# EAGLE design Arducard (EAGLE 6.5.0)
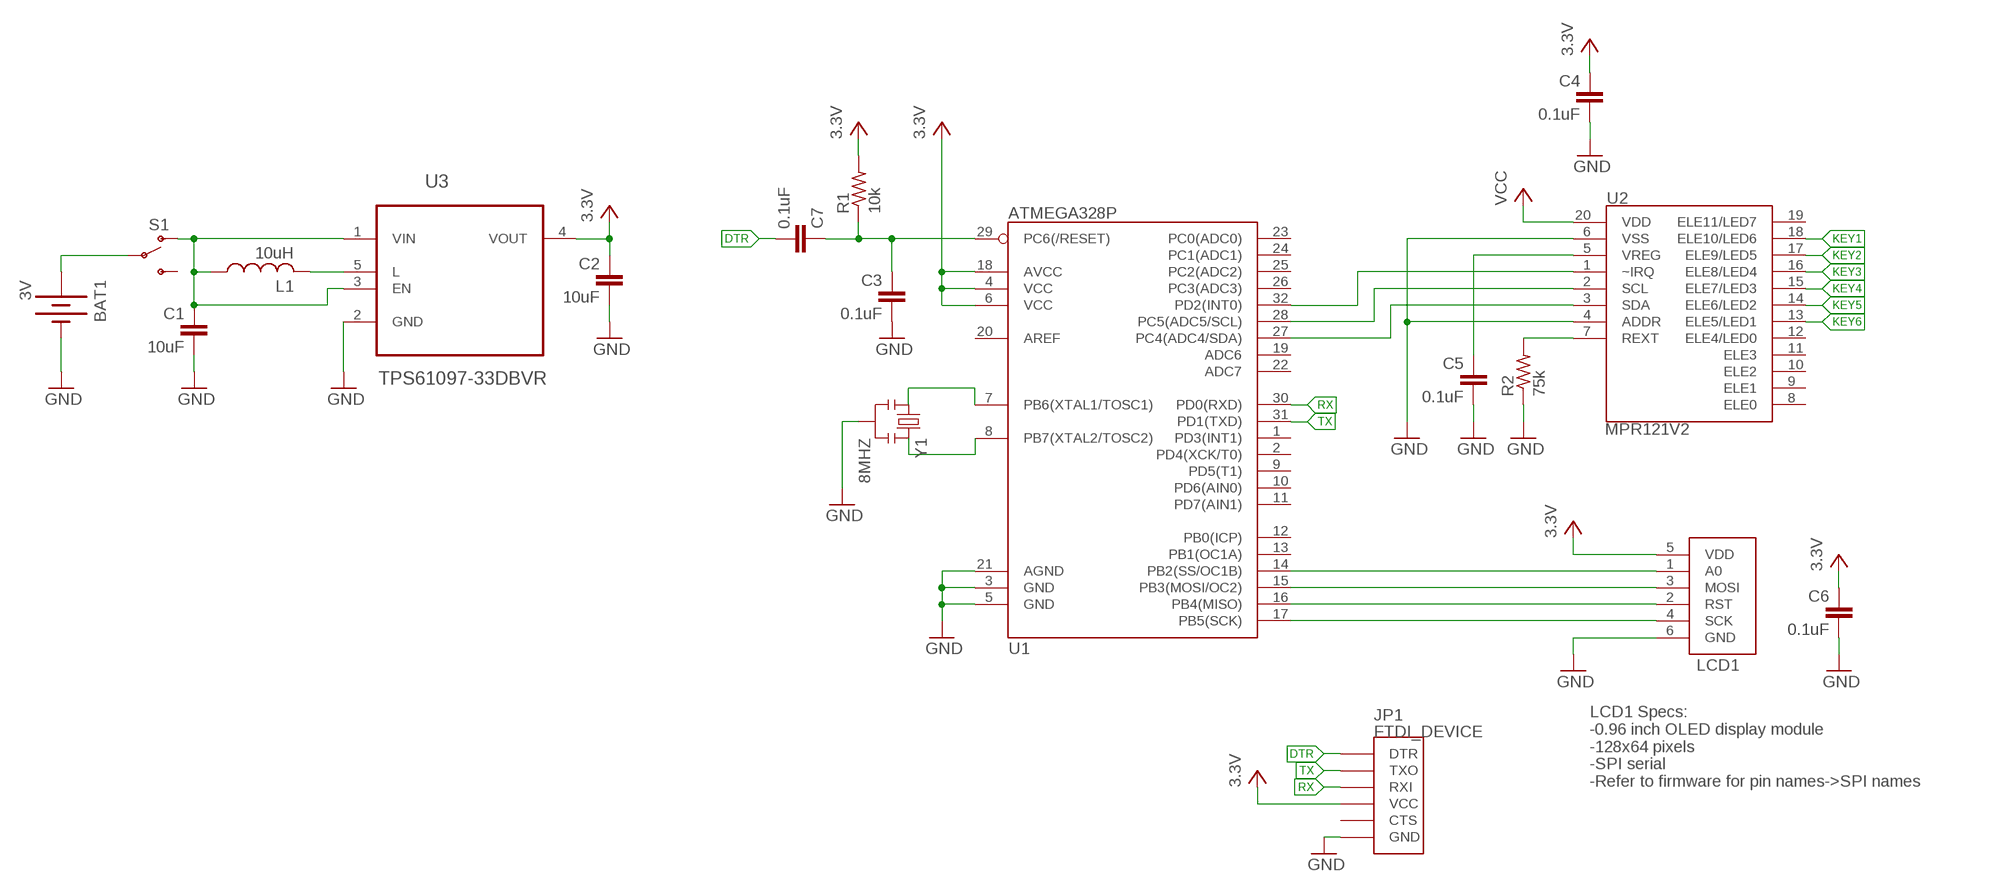
[diagram p0: schematic, sheet 1]

## Parts
BAT1  3V  BATTERY20MM_4LEGS  [BATTCON_20MM_4LEGS]
C1  10uF  C-EUC0603K  [C0603K]
C2  10uF  C-EUC0603K  [C0603K]
C3  0.1uF  C-EUC0603K  [C0603K]
C4  0.1uF  C-EUC0603K  [C0603K]
C5  0.1uF  C-EUC0603K  [C0603K]
C6  0.1uF  C-EUC0603K  [C0603K]
C7  0.1uF  C-EUC0603K  [C0603K]
JP1  FTDI_DEVICE  [FTDI_DEVICE_SIDE]
L1  10uH  L-USL2012C  [L2012C]
LCD1  LCD  [LCD]
R1  10k  R-US_R0603  [R0603]
R2  75k  R-US_R0603  [R0603]
S1  SWITCH-SPDTSMD2  [SWITCH-SPDT-SMD]
U1  ATMEGA328P  ATMEGA328_SMT  [TQFP32-08]
U2  MPR121V2  [QFN-20-0.4MM-V2]
U3  TPS61097-33DBVR  [SOT95P280X145-5N]
Y1  8MHZ  RESONATOR16MHZ  [RESONATOR-SMD]

## Nets
DTR: C7.2 JP1.P$1(DTR)
GND: BAT1.2(-) C1.2 C2.2 C3.2 C4.2 C5.2 C6.2 JP1.P$6(GND) LCD1.6(GND) R2.1 U1.3(GND) U1.5(GND) U1.21(AGND) U2.4(ADDR) U2.6(VSS) U3.2(GND) Y1.2
KEY1: U2.18(ELE10/LED6)
KEY2: U2.17(ELE9/LED5)
KEY3: U2.16(ELE8/LED4)
KEY4: U2.15(ELE7/LED3)
KEY5: U2.14(ELE6/LED2)
KEY6: U2.13(ELE5/LED1)
N$1: LCD1.4(SCK) U1.17(PB5(SCK))
N$2: LCD1.2(RST) U1.16(PB4(MISO))
N$3: LCD1.3(MOSI) U1.15(PB3(MOSI/OC2))
N$4: LCD1.1(A0) U1.14(PB2(SS/OC1B))
N$5: R2.2 U2.7(REXT)
N$6: C5.1 U2.5(VREG)
N$7: U1.32(PD2(INT0)) U2.1(~IRQ)
N$8: U1.28(PC5(ADC5/SCL)) U2.2(SCL)
N$9: U1.27(PC4(ADC4/SDA)) U2.3(SDA)
N$10: U1.7(PB6(XTAL1/TOSC1)) Y1.1
N$11: U1.8(PB7(XTAL2/TOSC2)) Y1.3
N$12: C3.1 C7.1 R1.1 U1.29(PC6(/RESET))
N$15: L1.2 U3.5(L)
N$16: C1.1 L1.1 S1.1(O) U3.1(VIN) U3.3(EN)
N$17: BAT1.P$2(+) S1.2(P)
RX: JP1.P$3(RXI) U1.30(PD0(RXD))
TX: JP1.P$2(TXO) U1.31(PD1(TXD))
VCC: C2.1 C4.1 C6.1 JP1.P$4(VCC) LCD1.5(VDD) R1.2 U1.4(VCC) U1.6(VCC) U1.18(AVCC) U2.20(VDD) U3.4(VOUT) ; supply symbol labelled 3.3V
Unconnected: JP1.P$5(CTS) S1.3(S) U1.1(PD3(INT1)) U1.2(PD4(XCK/T0)) U1.9(PD5(T1)) U1.10(PD6(AIN0)) U1.11(PD7(AIN1)) U1.12(PB0(ICP)) U1.13(PB1(OC1A)) U1.19(ADC6) U1.20(AREF) U1.22(ADC7) U1.23(PC0(ADC0)) U1.24(PC1(ADC1)) U1.25(PC2(ADC2)) U1.26(PC3(ADC3)) U2.8(ELE0) U2.9(ELE1) U2.10(ELE2) U2.11(ELE3) U2.12(ELE4/LED0) U2.19(ELE11/LED7)

## Notes on the sheet
- LCD1 Specs:
  -0.96 inch OLED display module
  -128x64 pixels
  -SPI serial
  -Refer to firmware for pin names->SPI names

## Library data of the parts
BAT1 = SparkFun-Electromechanical:BATTERY: Battery Holders Various common sizes : AA, AAA, 20mm coin cell and 12mm coin cell. 20MM_4LEGS, BATT-10373; OC_NEWARK: unknown; PROD_ID: BATT-10373; VALUE: 20mm coincell
C1-C7 = resistor:C-EU: CAPACITOR, European symbol; OC_NEWARK: unknown
JP1 = SparkFun-Connectors:FTDI_DEVICE: Connector which mates to FTDI basic or FTDI cable.; OC_NEWARK: unknown
L1 = rcl:L-US: INDUCTOR, American symbol; MPN: CKS21254R7M-T; OC_NEWARK: 83T0112
LCD1 = LCD:LCD; OC_NEWARK: unknown
R1 R2 = resistor:R-US_: RESISTOR, American symbol; OC_NEWARK: unknown
S1 = SparkFun-Electromechanical:SWITCH-SPDT: SPDT Switch Simple slide switch, Spark Fun Electronics SKU : COM-00102 DPDT SMT slide switch, AYZ0202, SWCH-08179; OC_NEWARK: unknown
U1 = SparkFun-DigitalIC(Alex):ATMEGA328_SMT: 32-Pin Atmega328 part Commonly used on Arduino compatible boards Available in QFP and QFN packages TQFP is IC-09069 QFN is non-stock; OC_NEWARK: unknown; PROD_ID: IC-09069
U2 = SparkFun-Sensors:MPR121: MPR121 Capacitive Touch Sensor Controller. Variant "V2" was created using an image import of the bottom of the IC. It matches metal to metal.; OC_NEWARK: unknown
U3 = Texas Instruments_By_element14_Batch_1:TPS61097-33DBVR: LOW INPUT VOLTAGE SYNCHRONOUS BOOST CONVERTER; MPN: TPS61097-33DBVR; OC_FARNELL: -; OC_NEWARK: 25R0111; PACKAGE: SOT-23-5; SUPPLIER: Texas Instruments
Y1 = SparkFun-FreqCtrl:RESONATOR: Resonator Small SMD resonator. Used, eg, on the Arduino Pro/ Pro Mini boards. 8MHz- XTAL-08895 16MHz- XTAL-08900; OC_NEWARK: unknown; PROD_ID: XTAL-08900; VALUE: 16MHZ

## Board
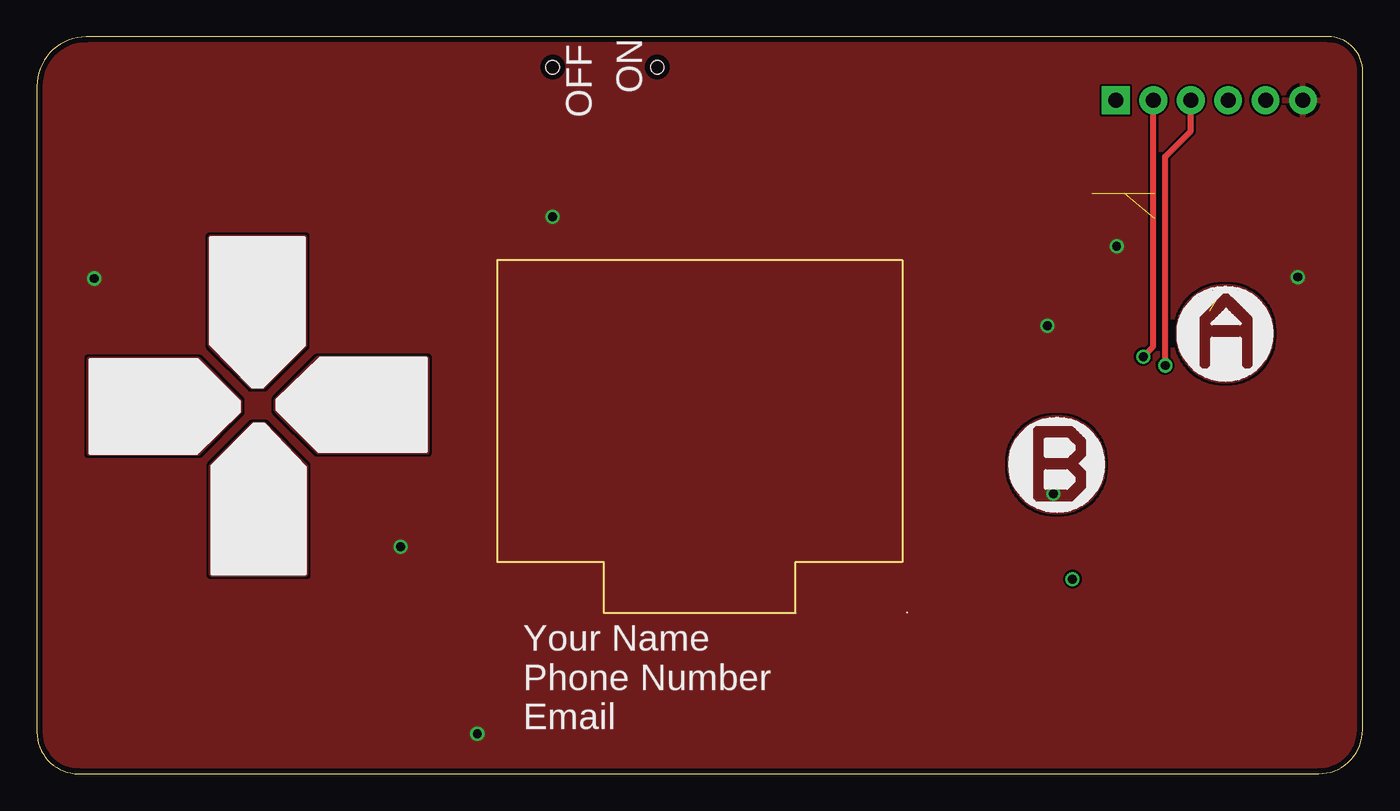
[diagram p1: board, top side]
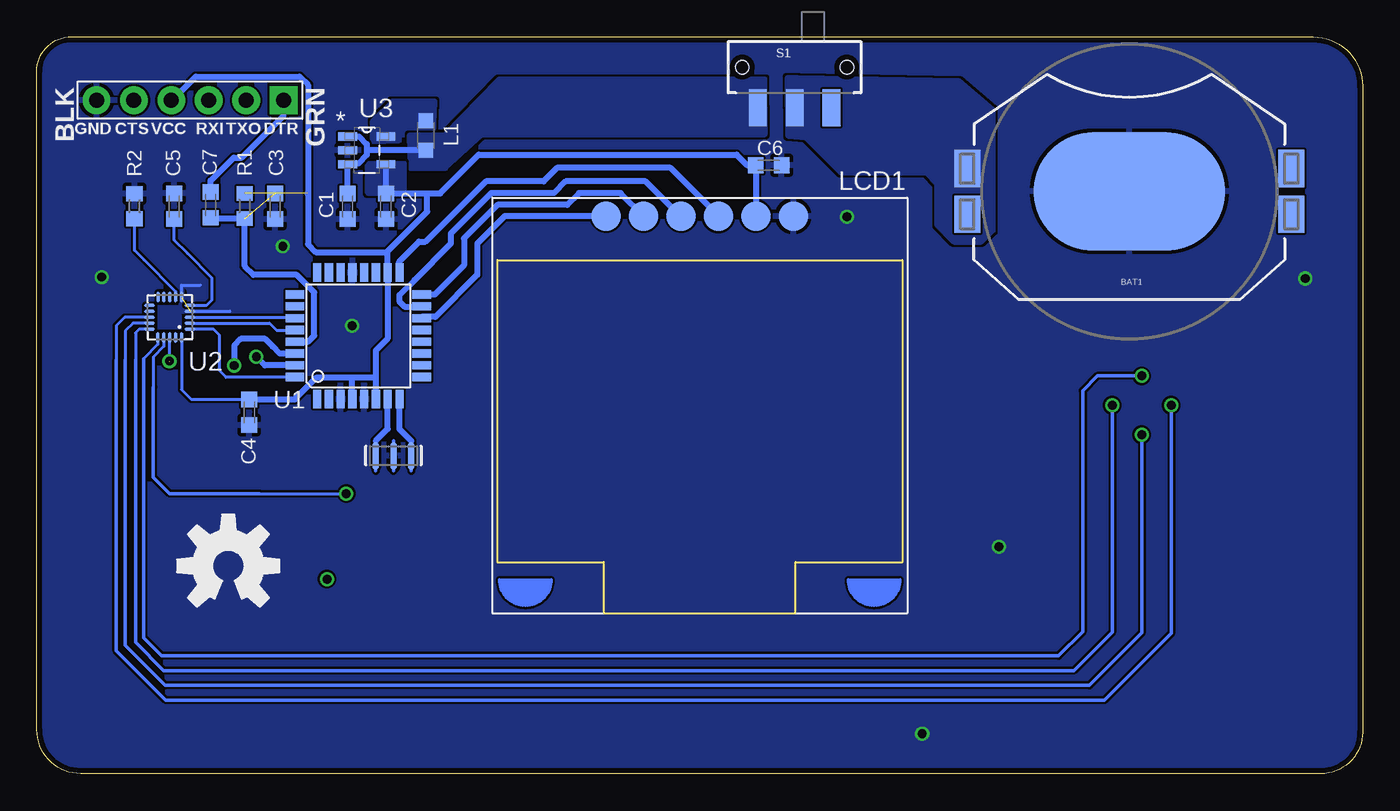
[diagram p2: board, bottom side, seen from below]

Size 90 x 50 mm. Coordinates in mm from the lower left corner, seen from the top.
Outline: 0,46.64 0,2.83 arc90 2.83,0 87.03,0 arc90 90,2.97 90,47.67 arc90 87.67,50 3.36,50 arc90 0,46.64
Copper layers (1*16): Top 0.0356mm / dielectric 1.5011mm / Bottom 0.0356mm
Design rules "oshPark": minimum track width 6mil, minimum drill 13mil, track to track 6mil, track to pad 6mil, pad to pad 6mil, via to via 6mil, smd to smd 6mil, copper to edge 15mil, drill to drill 6mil, minimum pad ring 7mil, minimum via ring 7mil, stop-mask expansion 3mil, vias tented up to drill 0mil, thermal gap 10mil

### Footprints (pad centres in the part's own frame; a part is rotated, then mirrored left to right if it is on the bottom)
BATTCON_20MM_4LEGS = smd 1.778 x 2.54: 1 -11,1.55; 3 11,1.55; P$1 -11,-1.55; P$2 11,-1.55 | smd 13 x 8: 2 0,0
C0603K = smd 1.05 x 1.08: 1 -0.875,0; 2 0.875,0
FTDI_DEVICE_SIDE = drill 1.016 pad 1.88 square: P$1 -6.35,0 | drill 1.016 pad 1.88: P$2 -3.81,0; P$3 -1.27,0; P$4 1.27,0; P$5 3.81,0; P$6 6.35,0
L2012C = smd 1 x 1: 1 -1,0; 2 1,0
LCD = smd 1.999 x 1.999: 1 6.35,-12.827; 2 3.81,-12.827; 3 1.27,-12.827; 5 -3.81,-12.827; 6 -6.35,-12.827 | smd 1.999 x 1.999 rotated 225: 4 -1.27,-12.827
R0603 = smd 1 x 1.1: 1 -0.85,0; 2 0.85,0
SWITCH-SPDT-SMD = smd 1.2 x 2.5: 1 -2.5,-2.75; 2 0,-2.75; 3 2.5,-2.75 | hole 0.9: -3.55,0; 3.55,0
TQFP32-08 = smd 1.27 x 0.559: 1 -4.293,2.8; 2 -4.293,2; 3 -4.293,1.2; 4 -4.293,0.4; 5 -4.293,-0.4; 6 -4.293,-1.2; 7 -4.293,-2; 8 -4.293,-2.8; 17 4.293,-2.8; 18 4.293,-2; 19 4.293,-1.2; 20 4.293,-0.4; 21 4.293,0.4; 22 4.293,1.2; 23 4.293,2; 24 4.293,2.8 | smd 0.559 x 1.27: 9 -2.8,-4.293; 10 -2,-4.293; 11 -1.2,-4.293; 12 -0.4,-4.293; 13 0.4,-4.293; 14 1.2,-4.293; 15 2,-4.293; 16 2.8,-4.293; 25 2.8,4.293; 26 2,4.293; 27 1.2,4.293; 28 0.4,4.293; 29 -0.4,4.293; 30 -1.2,4.293; 31 -2,4.293; 32 -2.8,4.293
QFN-20-0.4MM-V2 = smd 0.75 x 0.195: 1 -1.367,0.8; 2 -1.367,0.4; 3 -1.367,0; 4 -1.367,-0.4; 5 -1.367,-0.8; 11 1.375,-0.8; 12 1.375,-0.4; 13 1.375,0; 14 1.375,0.4; 15 1.375,0.8 | smd 0.195 x 0.75: 6 -0.795,-1.372; 7 -0.395,-1.372; 8 0.005,-1.372; 9 0.405,-1.372; 10 0.805,-1.372; 16 0.81,1.372; 17 0.41,1.372; 18 0.01,1.372; 19 -0.39,1.372; 20 -0.79,1.372
SOT95P280X145-5N = smd 1.27 x 0.559: 1 -1.295,0.94; 2 -1.295,0; 3 -1.295,-0.94; 4 1.295,-0.94; 5 1.295,0.94
RESONATOR-SMD = smd 0.45 x 1.905: 1 -1.2,0; 2 0,0; 3 1.2,0

### Placement (x,y rotation side)
BAT1  15.84,39.51 180 bottom
C1  68.9,38.5 270 bottom
C2  66.3,38.5 270 bottom
C3  73.82,38.5 270 bottom
C4  75.58,24.53 270 bottom
C5  80.67,38.5 90 bottom
C6  40.32,41.29 0 bottom
C7  78.2,38.6 90 bottom
JP1  79.6,45.7 180 bottom
L1  63.6,43.3 90 bottom
LCD1  45,25 180 bottom
R1  75.89,38.52 90 bottom
R2  83.37,38.5 270 bottom
S1  38.56,47.94 0 bottom
U1  68.18,29.71 90 bottom
U2  80.97,30.97 180 bottom
U3  67.6,42.3 0 bottom
U$1  [OSHW-LOGO-L]  77,14.1 0 bottom
Y1  65.79,21.57 0 bottom

### Tracks (layer width: path | path; a pad name or v marks a point on that pad's centre or on a via)
DTR
  Bottom 0.406: C7.2 78.2,40.24 76.64,41.8 76.08,41.8 73.25,44.63 JP1.P$1
GND  (via drill 0.6)  (1 unrouted)
  Bottom 0.191: U2.6 80.18,33.15 78.9,33.15 | U2.4 76.9,31.37 76.9,31.4
  Bottom 0.254: U1.21
  other vias: 3.9,33.6 24.7,15.4 73.3,35.8 85.6,33.7 68.6,30.4 35,37.8 29.9,2.7
  pour Bottom (rank 6): -1,48.56 -1,1.62 arc90 1.62,-1 88.72,-1 arc90 91,1.28 91,48.56 arc90 88.56,51 1.44,51 arc90
  pour Top (rank 2): 89.11,-1 1.24,-1 arc-90 -1,1.24 -1,48.61 arc-90 1.39,51 88.31,51 arc-90 91,48.31 91,0.89 arc-90
KEY1  (via drill 0.6)  (1 unrouted)
  Bottom 0.191: 80.99,27.97 80.98,27.97 U2.18
  Bottom 0.254: 81.02,28 v81,28
  pour Top: 80.68,26.67 arc90 83.82,29.81 83.82,29.94 arc90 80.74,33.02 80.61,33.02 arc90 77.47,29.88 arc90
KEY2  (via drill 0.6)
  Bottom 0.191: U2.17 | U2.17 81.38,28.99 82.1,28.27 82.1,26.23 | 74.88,19 v69,19
  Bottom 0.254: 74.88,19 80.97,19 82.1,20.13 82.1,26.23
  pour Top: 69.25,17.78 arc90 72.39,20.92 72.39,21.05 arc90 69.31,24.13 69.18,24.13 arc90 66.04,20.99 arc90
KEY3  (via drill 0.6)
  Bottom 0.191: U2.16 | U2.16 81.78,29.12 82.75,28.16
  Bottom 0.254: v15,27 18,27 19,26 19,9.64 20.64,8 81.51,8 82.75,9.23 82.75,28.16
  pour Top: 11.81,36.4 18.16,36.4 18.16,29.08 15.32,26.24 14.65,26.24 11.81,29.08
KEY4  (via drill 0.6)
  Bottom 0.191: U2.15 83.04,30.17 83.3,29.91 83.3,28.1
  Bottom 0.254: v17,25 17,9.61 19.61,7 81.38,7 83.3,8.92 83.3,28.1
  pour Top: 26.45,28.18 26.45,21.83 19.13,21.83 16.29,24.67 16.29,25.34 19.13,28.18
KEY5  (via drill 0.6)
  Bottom 0.191: U2.14 83.47,30.57 84,30.04 84,28.1
  Bottom 0.254: v15,23 15,9.55 18.55,6 81.3,6 84,8.7 84,28.1
  pour Top: 18.23,13.54 11.88,13.54 11.88,20.86 14.72,23.7 15.39,23.7 18.23,20.86
KEY6  (via drill 0.6)
  Bottom 0.191: U2.13 84.03,30.97 84.6,30.4 84.6,28.1
  Bottom 0.254: v13,25 13,9.53 17.53,5 81.25,5 84.6,8.35 84.6,28.1
  pour Top: 3.59,21.76 3.59,28.11 10.91,28.11 13.75,25.27 13.75,24.6 10.91,21.76
N$1
  Bottom 0.406: LCD1.4 43.7,37.83 46.97,41.1 54.7,41.1 55.6,40.2 59.51,40.2 63.61,36.1 64.06,36.1 65.4,34.76 65.4,34 U1.17
N$2
  Bottom 0.406: LCD1.2 50.37,39.4 53.2,39.4 54,38.6 58.73,38.6 61,36.33 61,34.48 62.98,32.5 U1.16
N$3
  Bottom 0.406: LCD1.3 46.3,37.83 48.67,40.2 54.1,40.2 54.9,39.4 59.15,39.4 61.9,36.65 61.9,35.97 64.37,33.5 65.4,32.47 65.4,32.06 65.04,31.7 U1.15
N$4
  Bottom 0.406: LCD1.1 58.24,37.83 60.1,35.97 60.1,33.84 62.94,31 63.89,31 U1.14
N$5
  Bottom 0.191: U2.7 80.57,32.72 82.72,34.87 83.37,35.52 R2.2
N$6
  Bottom 0.191: U2.5 78.48,31.77 78.1,32.15 78.1,33.64 79.76,35.3 80.67,36.21 C5.1
N$7
  Bottom 0.191: U2.1 78,30.17 77.6,29.77 77.6,27.35 77.15,26.9 U1.32
N$8
  Bottom 0.191: U2.2 74.2,30.57 73.73,30.1 U1.28
N$9
  Bottom 0.191: U2.3 72.47,30.97 U1.27
N$10
  Bottom 0.406: 66.99,22.59 66.18,23.4 U1.7
N$11
  Bottom 0.406: 64.59,22.59 65.38,23.38 U1.8
N$12  (1 unrouted)
  Bottom 0.406: U1.29 71.58,29.31 71.17,29.72 71.17,32.66 72.35,33.84 75.29,33.84 75.89,34.44 R1.1 | 75.89,37.62 R1.1 | R1.1 78.2,37.67 C7.1
N$15
  pour Bottom (rank 3, no thermals): 63.1,43.4 63,45.6 65.86,45.6 67.2,44.26 67.2,44.1 67.2,42.9 65.4,43 65.4,43.4
N$16
  Bottom 0.406: C1.1 U3.3 68.89,41.4 68.17,41.4 67.6,41.97 67.6,42.3 | U3.1 68.12,43.24 67.6,42.72 67.6,42.3 | L1.1 67.6,42.3 | 41.1,45.19 S1.1
  pour Bottom (rank 2, no thermals): 40.6,47.1 58.62,47.1 62.3,43.32 64.69,43.3 64.63,41.1 62.28,41.1 59.78,43.4 40.58,43.4
N$17
  pour Bottom (no thermals): 38.4,47.2 39.04,47.2 39,43.3 37.8,43.2 35.4,40.8 29.62,40.8 28.9,40.08 28.9,37.27 27.73,36.1 25.91,36.1 25.1,36.91 25.1,45 27.4,46.98
N$24  (via drill 0.6)
  other vias: 70.3,13.2
RX  (via drill 0.6)
  Top 0.406: v76.6,27.7 76.6,41.87 78.33,43.6 JP1.P$3
  Bottom 0.406: U1.30 73.51,28.51 74,29 74.5,29.5 76.15,29.5 76.6,29.05 v76.6,27.7
TX  (via drill 0.6)
  Top 0.406: v75.1,28.3 75.79,28.99 JP1.P$2
  Bottom 0.406: U1.31 74.51,27.71 v75.1,28.3
VCC  (1 unrouted)
  Bottom 0.191: U2.20 | U2.20 80.18,26.06 79.52,25.4 C4.1
  Bottom 0.406: U3.4 C2.1 63.5,39.38 | LCD1.5 C6.1 41.8,41.3 42.5,42 60,42 62.62,39.38 63.5,39.38 | R1.2 76.03,39.37 | 66.2,34 66.2,29.5 67,28.7 67,26.89 | U1.6 67,25.42 67,26.89 | U1.18 66.2,34 | 66.2,34 66.2,35.4 | 63.5,39.38 63.5,38.14 66.2,35.44 66.2,35.4 | C4.1 72.49,25.4 71,26.89 68.6,26.89 | 68.6,26.89 67,26.89 | U1.4 68.6,25.42 68.6,26.89 | 71.62,39.38 71.6,39.35 | 71.6,39.35 71.6,35.94 71.06,35.4 66.2,35.4 | JP1.P$4 80.8,45.7 79.2,47.3 72.17,47.3 71.6,46.73 71.6,39.35
  pour Bottom (no thermals): 65.1,39.4 67.5,39.4 67.5,41.4 65.1,41.4

### Text on the board
tPlace: OFF | ON | Your Name / Phone Number / Email